# Altium schematic sheet 3v3_power.SchDoc: 3v3 Power Regulator
size A4; DocumentNumber: 9; SheetNumber: 9; SheetTotal: 12
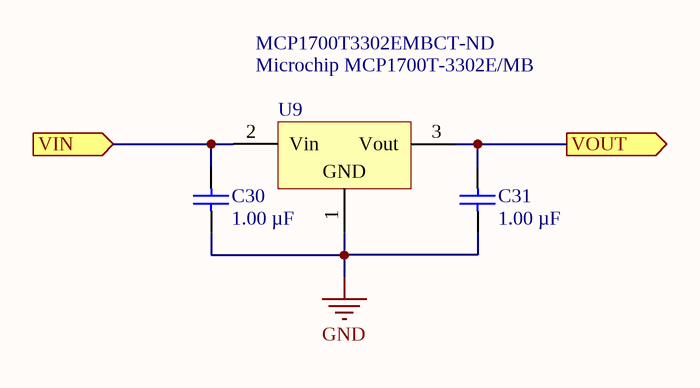
[diagram p0: 3v3_power.SchDoc]

## Parts
C30  Capacitance: 1.00 µF  [PCB-xrh88671zmf2jss4mnlt-1]  (hidden comment: Würth Elektronik 885012207051)
C31  Capacitance: 1.00 µF  [PCB-xrh88671zmf2jss4mnlt-1]  (hidden comment: Würth Elektronik 885012207051)
U9  Microchip MCP1700T-3302E/MB  [SOT-89-MB3_L]

## Ports
VIN (in), VOUT (out)

## Nets
GND: C30.1 C31.1 U9.1(GND)
VIN: C30.2 U9.2(Vin) ; port VIN
VOUT: C31.2 U9.3(Vout) ; port VOUT

## Notes on the sheet
- MCP1700T3302EMBCT-ND
- Title
- Size:
- Date:
- A4
- Engineer:
- Time:
- Sheet
- Revision:
- of
- File:

## Library data of the parts
C30 C31 = CMP-7104bbe86e53aec3-1: Capacitor [Würth Elektronik] 885012207051 Capacitor; Capacitance Tolerance: ±10%; Dielectric Characteristic: X7R; Voltage Rating (DC): 16.0 V; Octopart URL: https://octopart.com/885012207051-w%C3%BCrth+elektronik-65419825; Manufacturer Part Number: 885012207051; Packaging: Cut Tape (CT); RoHS: Compliant; OctopartID: 7104bbe86e53aec3
U9 = CMP-1493175-4: LDO voltage regulator [Microchip] MCP1700T-3302E/MB LDO voltage regulator; Quiescent Current: 1.60 µA; Lead-Free Status: Lead Free; Mounting Style: Surface Mount; Number of Pins: 3; Lifecycle Status: Active